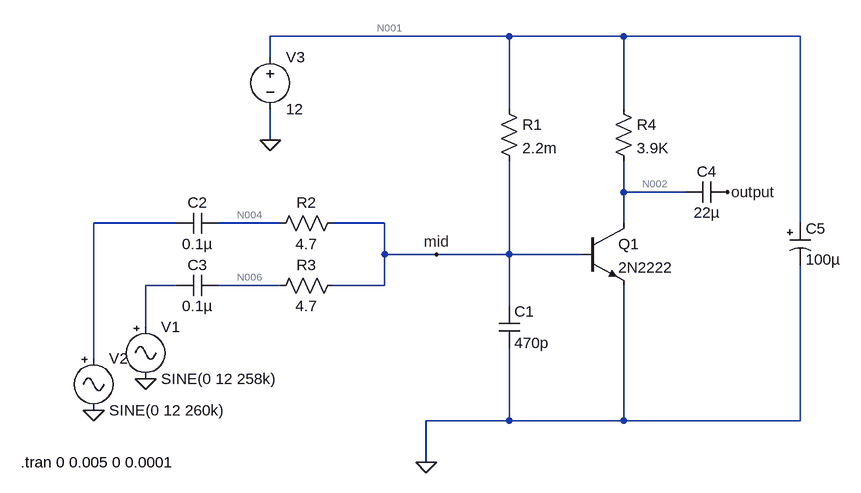
[diagram p0: schematic improvedHomeBuildMixer.asc]
improvedHomeBuildMixer.asc, the LTspice schematic file:
Version 4
SHEET 1 880 680
WIRE 208 -176 -160 -176
WIRE 384 -176 208 -176
WIRE 656 -176 384 -176
WIRE -160 -144 -160 -176
WIRE 208 -64 208 -176
WIRE 384 -64 384 -176
WIRE -160 -16 -160 -64
WIRE 384 64 384 16
WIRE 480 64 384 64
WIRE -304 112 -432 112
WIRE -144 112 -240 112
WIRE 16 112 -64 112
WIRE 384 112 384 64
WIRE 656 112 656 -176
WIRE 16 160 16 112
WIRE 96 160 16 160
WIRE 208 160 208 16
WIRE 208 160 96 160
WIRE 320 160 208 160
WIRE -304 208 -352 208
WIRE -144 208 -240 208
WIRE 16 208 16 160
WIRE 16 208 -64 208
WIRE 208 240 208 160
WIRE -352 272 -352 208
WIRE -432 320 -432 112
WIRE 208 416 208 304
WIRE 208 416 80 416
WIRE 384 416 384 208
WIRE 384 416 208 416
WIRE 656 416 656 176
WIRE 656 416 384 416
WIRE 80 480 80 416
FLAG -352 352 0
FLAG -432 400 0
FLAG 96 160 mid
FLAG -160 -16 0
FLAG 544 64 output
FLAG 80 480 0
SYMBOL res -48 96 R90
WINDOW 0 0 56 VBottom 2
WINDOW 3 32 56 VTop 2
SYMATTR InstName R2
SYMATTR Value 4.7
SYMBOL res -48 192 R90
WINDOW 0 0 56 VBottom 2
WINDOW 3 32 56 VTop 2
SYMATTR InstName R3
SYMATTR Value 4.7
SYMBOL cap -240 96 R90
WINDOW 0 0 32 VBottom 2
WINDOW 3 32 32 VTop 2
SYMATTR InstName C2
SYMATTR Value 0.1µ
SYMBOL cap -240 192 R90
WINDOW 0 0 32 VBottom 2
WINDOW 3 32 32 VTop 2
SYMATTR InstName C3
SYMATTR Value 0.1µ
SYMBOL Misc\\signal -352 256 R0
WINDOW 123 0 0 Left 0
WINDOW 39 0 0 Left 0
SYMATTR InstName V1
SYMATTR Value SINE(0 12 258k)
SYMBOL Misc\\signal -432 304 R0
WINDOW 123 0 0 Left 0
WINDOW 39 0 0 Left 0
SYMATTR InstName V2
SYMATTR Value SINE(0 12 260k)
SYMBOL cap 192 240 R0
SYMATTR InstName C1
SYMATTR Value 470p
SYMBOL cap 544 48 R90
WINDOW 0 0 32 VBottom 2
WINDOW 3 32 32 VTop 2
SYMATTR InstName C4
SYMATTR Value 22µ
SYMBOL res 192 -80 R0
SYMATTR InstName R1
SYMATTR Value 2.2m
SYMBOL res 368 -80 R0
SYMATTR InstName R4
SYMATTR Value 3.9K
SYMBOL polcap 640 112 R0
SYMATTR InstName C5
SYMATTR Value 100µ
SYMATTR SpiceLine V=16
SYMBOL voltage -160 -160 R0
WINDOW 123 0 0 Left 0
WINDOW 39 0 0 Left 0
SYMATTR InstName V3
SYMATTR Value 12
SYMBOL npn 320 112 R0
SYMATTR InstName Q1
SYMATTR Value 2N2222
TEXT -544 480 Left 2 !.tran 0 0.005 0 0.0001

The netlist it stands for:
* improvedHomeBuildMixer.asc
R2 mid N004 4.7
R3 mid N006 4.7
C2 N004 N003 0.1µ
C3 N006 N005 0.1µ
V1 N005 0 SINE(0 12 258k)
V2 N003 0 SINE(0 12 260k)
C1 mid 0 470p
C4 output N002 22µ
R1 N001 mid 2.2m
R4 N001 N002 3.9K
C5 N001 0 100µ V=16
V3 N001 0 12
Q1 N002 mid 0 0 2N2222
.model NPN NPN
.model PNP PNP
.lib standard.bjt
.tran 0 0.005 0 0.0001
.backanno
.end

* Results of the author's LTspice run, read from the files saved beside the schematic
* Operating Point, zero values left out:
*   V(mid) = 12 V
*   V(n004) = 12 V
*   V(n006) = 12 V
*   V(output) = 5.465 µV
*   V(n002) = 248.4 mV
*   V(n001) = 12 V
*   Ic(Q1) = 3.013 mA
*   Ib(Q1) = 1.089 A
*   Ie(Q1) = -1.092 A
*   I(R1) = 1.089 A
*   I(R4) = 3.013 mA
*   I(V3) = -1.092 A